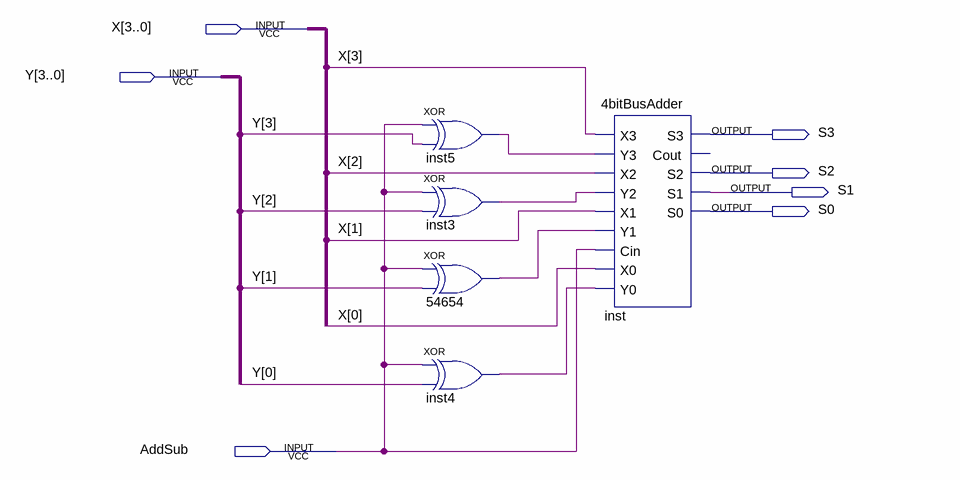
[diagram p0: schematic sheet]
// Quartus schematic addingSubtracting.bdf as structural Verilog: 5 symbols, 7 pins
module addingSubtracting (
  input  [3:0] X,
  input  [3:0] Y,
  input  AddSub,
  output S3,
  output S2,
  output S1,
  output S0
);

  wire inst3_out, inst4_out, inst5_out, n54654_out;

  xor inst5 (inst5_out, AddSub, Y[3]);
  xor inst3 (inst3_out, AddSub, Y[2]);
  xor u_54654 (n54654_out, AddSub, Y[1]);
  xor inst4 (inst4_out, AddSub, Y[0]);
  \4bitBusAdder  inst (
    .X3(X[3]), .Y3(inst5_out), .X2(X[2]), .Y2(inst3_out), .X1(X[1]), .Y1(n54654_out), .Cin(AddSub),
    .X0(X[0]), .Y0(inst4_out), .S3(S3), .S2(S2), .S1(S1), .S0(S0));  // open: Cout
endmodule
